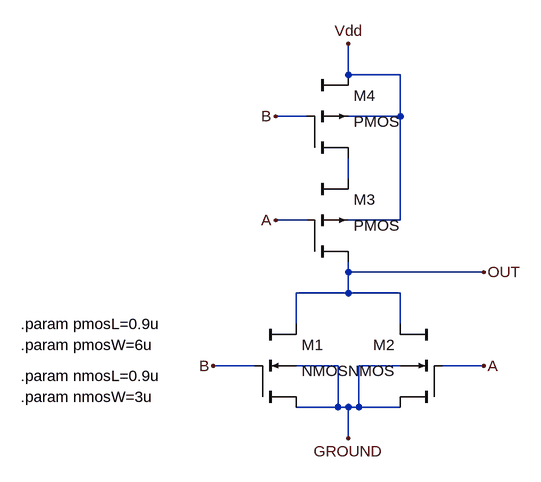
[diagram p0: schematic NOR.asc]
NOR.asc, the LTspice schematic file:
Version 4
SHEET 1 880 680
WIRE 224 -256 224 -304
WIRE 304 -256 224 -256
WIRE 160 -192 112 -192
WIRE 304 -192 304 -256
WIRE 304 -192 224 -192
WIRE 224 -96 224 -128
WIRE 160 -32 112 -32
WIRE 304 -32 304 -192
WIRE 304 -32 224 -32
WIRE 224 48 224 32
WIRE 432 48 224 48
WIRE 224 80 224 48
WIRE 224 80 144 80
WIRE 304 80 224 80
WIRE 144 128 144 80
WIRE 304 128 304 80
WIRE 80 192 16 192
WIRE 208 192 144 192
WIRE 304 192 240 192
WIRE 432 192 368 192
WIRE 208 256 208 192
WIRE 208 256 144 256
WIRE 224 256 208 256
WIRE 240 256 240 192
WIRE 240 256 224 256
WIRE 304 256 240 256
WIRE 224 304 224 256
FLAG 224 304 GROUND
FLAG 224 -304 Vdd
FLAG 432 48 OUT
FLAG 432 192 A
FLAG 112 -32 A
FLAG 112 -192 B
FLAG 16 192 B
SYMBOL cktsym\\nmos4 144 192 R0
SYMATTR InstName M1
SYMATTR Value2 l=nmosL w=nmosW
SYMBOL cktsym\\nmos4 304 192 M0
SYMATTR InstName M2
SYMATTR Value2 l=nmosL w=nmosW
SYMBOL cktsym\\pmos4 224 -32 R0
SYMATTR InstName M3
SYMATTR Value2 l=pmosL w=pmosW
SYMBOL cktsym\\pmos4 224 -192 R0
SYMATTR InstName M4
SYMATTR Value2 l=pmosL w=pmosW
TEXT -280 208 Left 2 !.param nmosL=0.9u
TEXT -280 240 Left 2 !.param nmosW=3u
TEXT -280 128 Left 2 !.param pmosL=0.9u
TEXT -280 160 Left 2 !.param pmosW=6u

The netlist it stands for:
* NOR.asc
M1 OUT B GROUND GROUND NMOS l=nmosL w=nmosW
M2 OUT A GROUND GROUND NMOS l=nmosL w=nmosW
M3 OUT A N001 Vdd PMOS l=pmosL w=pmosW
M4 N001 B Vdd Vdd PMOS l=pmosL w=pmosW
.model NMOS NMOS
.model PMOS PMOS
.lib standard.mos
.param nmosL=0.9u
.param nmosW=3u
.param pmosL=0.9u
.param pmosW=6u
.backanno
.end